# EAGLE board Sensor Board (EAGLE 6.5.0), part 1 of 2
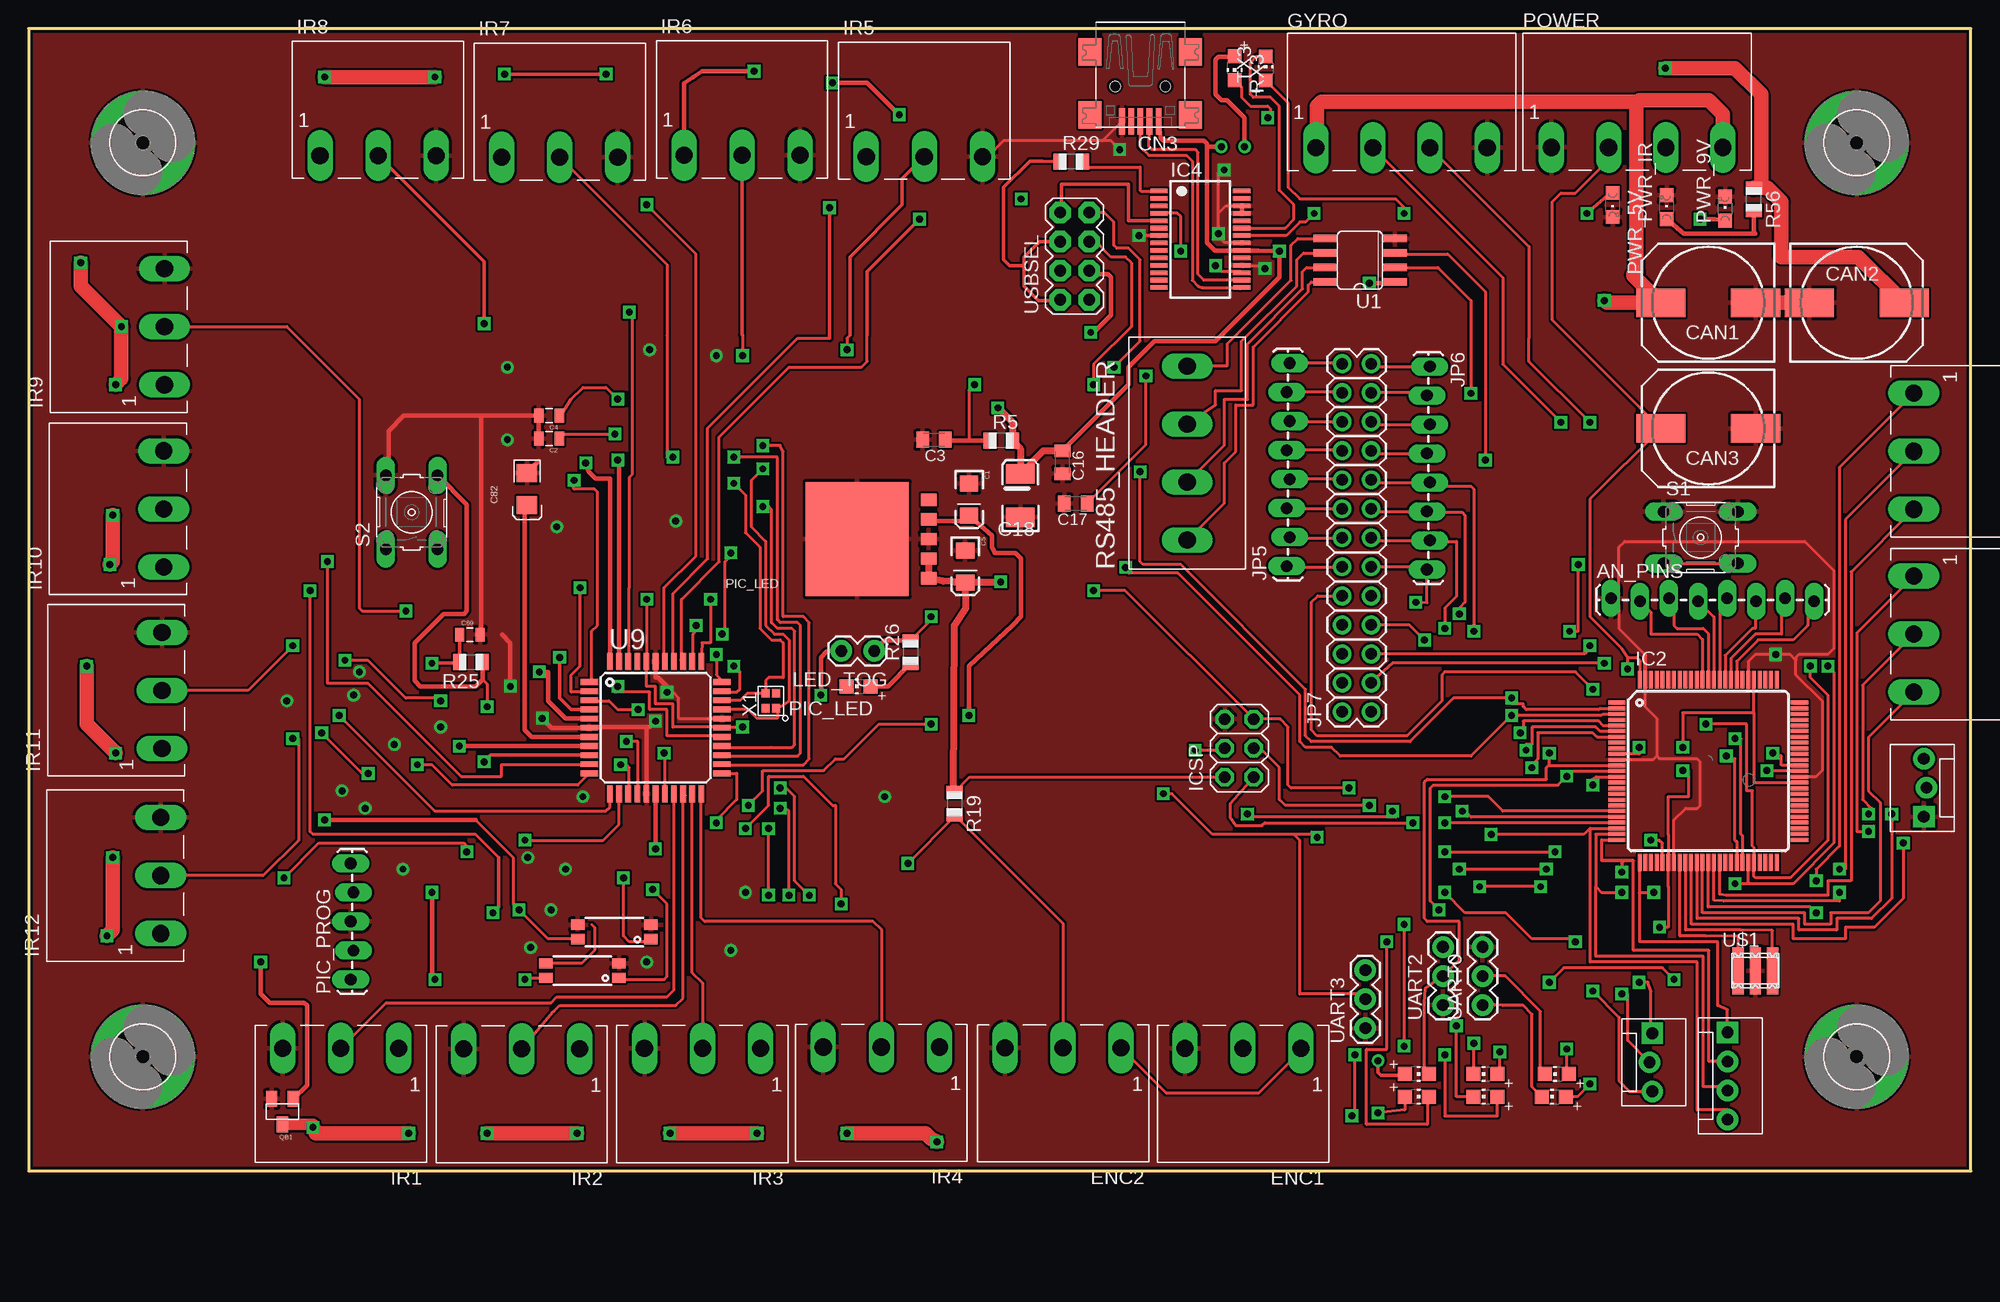
[diagram p3: board, top side]
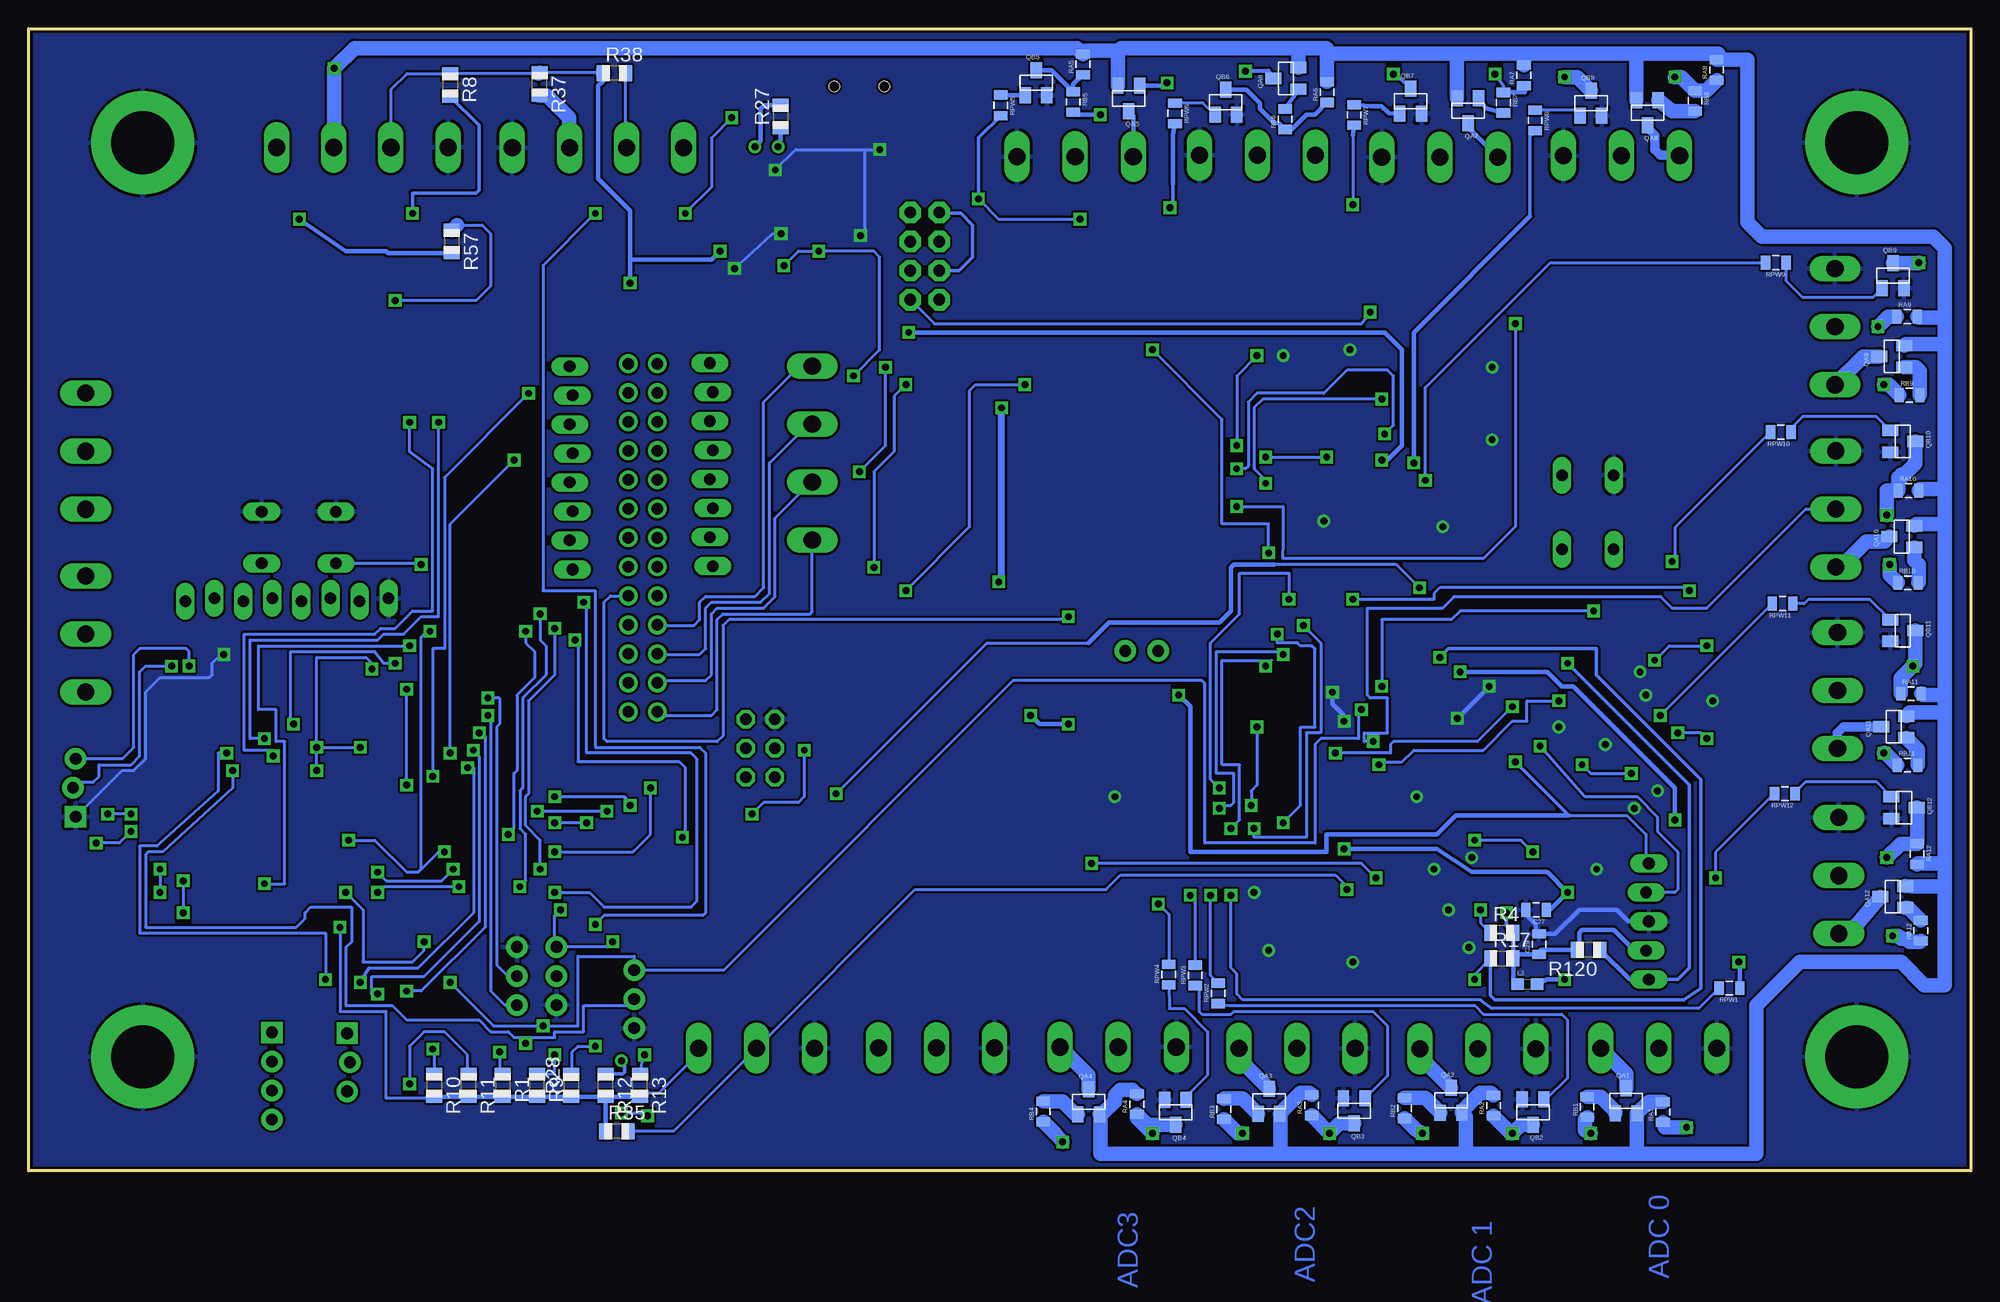
[diagram p4: board, bottom side, seen from below]

Size 170 x 100 mm. Coordinates in mm from the lower left corner, seen from the top.
Outline: 0,100 0,0 170,0 170,100 0,100
Copper layers (1*16): Top 0.035mm / dielectric 1.5mm / Bottom 0.035mm
Design rules "default": minimum track width 8mil, minimum drill 20mil, track to track 8mil, track to pad 8mil, pad to pad 8mil, via to via 8mil, smd to smd 8mil, copper to edge 10mil, drill to drill 8mil, minimum pad ring 12mil, minimum via ring 10mil, stop-mask expansion 4mil, vias tented up to drill 25mil, thermal gap 10mil
Net classes: 2 gnd: width 0.305 mm, drill 0.711 mm, clearance 0.203 mm; 3 usbvcc: width 0.508 mm, drill 0.711 mm, clearance 0.203 mm

## Footprints (pad centres in the part's own frame; a part is rotated, then mirrored left to right if it is on the bottom)
1X08_LOCK_LONGPADS = drill 1.016 long: 1 0,0.127; 2 2.54,-0.127; 3 5.08,0.127; 4 7.62,-0.127; 5 10.16,0.127; 6 12.7,-0.127; 7 15.24,0.127; 8 17.78,-0.127
EIA3216 = smd 1.4 x 1.6: A 1.4,0; C -1.4,0
0805 = smd 0.8 x 1.2: 1 -0.9,0; 2 0.9,0
C0805K = smd 1.1 x 1.4: 1 -1,0; 2 1,0
EIA3528-KIT = smd 1.7 x 2.5: A 1.9,0; C -1.9,0
POLC1206 = smd 1.6 x 1.8: 1 -1.4,0; 2 1.4,0
140CLH-1010 = smd 4.3 x 2.5: + 4.15,0; - -4.15,0
USB-MINIB = smd 0.5 x 2.308: D+ 0,4.064; D- -0.8,4.064; GND 1.6,4.064; ID 0.8,4.064; VBUS -1.6,4.064 | smd 2 x 2.4: GND1 -4.4,-2; GND2 -4.4,3.5; GND3 4.4,3.5; GND4 4.4,-2 | hole 0.9: -2.2,1; 2.2,1
MOLEX-1X3_LOCK = drill 1.016 pad 1.88 square: 1 0,0.127 | drill 1.016 pad 1.88: 2 2.54,-0.127; 3 5.08,0.127
HRP5 = smd 1.07 x 1.37: 1 -3.44,0; 2 -1.72,0; 3 0,0; 4 1.72,0; 5 3.44,0 | smd 10 x 9: G 0,6.254
M3 = drill 1.5 long: 1 -5.08,0; 2 0,0; 3 5.08,0
M4 = drill 1.5 long: 1 0,0; 2 5,0; 3 10,0; 4 15,0
5,5-PAD = drill 5.5 pad 9: B5,5 0,0
TQFP100 = smd 1.5 x 0.35: 1 -8,6; 2 -8,5.5; 3 -8,5; 4 -8,4.5; 5 -8,4; 6 -8,3.5; 7 -8,3; 8 -8,2.5; 9 -8,2; 10 -8,1.5; 11 -8,1; 12 -8,0.5; 13 -8,0; 14 -8,-0.5; 15 -8,-1; 16 -8,-1.5; 17 -8,-2; 18 -8,-2.5; 19 -8,-3; 20 -8,-3.5; 21 -8,-4; 22 -8,-4.5; 23 -8,-5; 24 -8,-5.5; 25 -8,-6; 51 8,-6; 52 8,-5.5; 53 8,-5; 54 8,-4.5; 55 8,-4; 56 8,-3.5; 57 8,-3; 58 8,-2.5; 59 8,-2; 60 8,-1.5; 61 8,-1; 62 8,-0.5; 63 8,0; 64 8,0.5; 65 8,1; 66 8,1.5; 67 8,2; 68 8,2.5; 69 8,3; 70 8,3.5; 71 8,4; 72 8,4.5; 73 8,5; 74 8,5.5; 75 8,6 | smd 0.35 x 1.5: 26 -6,-8; 27 -5.5,-8; 28 -5,-8; 29 -4.5,-8; 30 -4,-8; 31 -3.5,-8; 32 -3,-8; 33 -2.5,-8; 34 -2,-8; 35 -1.5,-8; 36 -1,-8; 37 -0.5,-8; 38 0,-8; 39 0.5,-8; 40 1,-8; 41 1.5,-8; 42 2,-8; 43 2.5,-8; 44 3,-8; 45 3.5,-8; 46 4,-8; 47 4.5,-8; 48 5,-8; 49 5.5,-8; 50 6,-8; 76 6,8; 77 5.5,8; 78 5,8; 79 4.5,8; 80 4,8; 81 3.5,8; 82 3,8; 83 2.5,8; 84 2,8; 85 1.5,8; 86 1,8; 87 0.5,8; 88 0,8; 89 -0.5,8; 90 -1,8; 91 -1.5,8; 92 -2,8; 93 -2.5,8; 94 -3,8; 95 -3.5,8; 96 -4,8; 97 -4.5,8; 98 -5,8; 99 -5.5,8; 100 -6,8
SSOP28 = smd 0.4 x 1.5: 1 -4.225,-3.625; 2 -3.575,-3.625; 3 -2.925,-3.625; 4 -2.275,-3.625; 5 -1.625,-3.625; 6 -0.975,-3.625; 7 -0.325,-3.625; 8 0.325,-3.625; 9 0.975,-3.625; 10 1.625,-3.625; 11 2.275,-3.625; 12 2.925,-3.625; 13 3.575,-3.625; 14 4.225,-3.625; 15 4.225,3.625; 16 3.575,3.625; 17 2.925,3.625; 18 2.275,3.625; 19 1.625,3.625; 20 0.975,3.625; 21 0.325,3.625; 22 -0.325,3.625; 23 -0.975,3.625; 24 -1.625,3.625; 25 -2.275,3.625; 26 -2.925,3.625; 27 -3.575,3.625; 28 -4.225,3.625
2X03 = drill 1.016 octagon: 1 -2.54,-1.27; 2 -2.54,1.27; 3 0,-1.27; 4 0,1.27; 5 2.54,-1.27; 6 2.54,1.27
2X13 = drill 1.016 pad 1.651: 1 0,0; 2 0,2.54; 3 2.54,0; 4 2.54,2.54; 5 5.08,0; 6 5.08,2.54; 7 7.62,0; 8 7.62,2.54; 9 10.16,0; 10 10.16,2.54; 11 12.7,0; 12 12.7,2.54; 13 15.24,0; 14 15.24,2.54; 15 17.78,0; 16 17.78,2.54; 17 20.32,0; 18 20.32,2.54; 19 22.86,0; 20 22.86,2.54; 21 25.4,0; 22 25.4,2.54; 23 27.94,0; 24 27.94,2.54; 25 30.48,0; 26 30.48,2.54
0603 = smd 1.1 x 1: 1 -0.85,0; 2 0.85,0
CHIP-LED0805 = smd 1.2 x 1.2: A 0,-1.05; C 0,1.05
1X02_LOCK = drill 1.016 pad 1.88: 1 -0.178,0; 2 2.718,0
SSOP-4 = smd 1.2 x 0.9: 1 -3.2,0.67; 2 -3.2,-0.6; 3 3.2,-0.6; 4 3.2,0.67
1X05_LOCK_LONGPADS = drill 1.016 long: 1 0,0; 2 2.54,-0.254; 3 5.08,0; 4 7.62,-0.254; 5 10.16,0
MOLEX-1X4 = drill 1.016 pad 1.88 square: 1 0,0 | drill 1.016 pad 1.88: 2 2.54,0; 3 5.08,0; 4 7.62,0
CHIPLED_0805 = smd 1.2 x 1.2: A 0,-1.05; C 0,1.05
SOT23 = smd 1 x 1.4: 1 -0.95,-1.1; 2 0.95,-1.1; 3 0,1.1
R0805 = smd 1.1 x 1.4: 1 -1,0; 2 1,0
M4-90 = drill 1.5 long: 1 0,0; 2 5.08,0; 3 10.16,0; 4 15.24,0
B3F-10XX = drill 1.016 long: 1 -3.251,2.261; 2 3.251,2.261; 3 -3.251,-2.261; 4 3.251,-2.261
SO08 = smd 0.66 x 2.032: 1 -1.905,-3.073; 2 -0.635,-3.073; 3 0.635,-3.073; 4 1.905,-3.073; 5 1.905,3.073; 6 0.635,3.073; 7 -0.635,3.073; 8 -1.905,3.073
TQFP-44 = smd 1.5 x 0.5: 1 -5.8,4; 2 -5.8,3.2; 3 -5.8,2.4; 4 -5.8,1.6; 5 -5.8,0.8; 6 -5.8,0; 7 -5.8,-0.8; 8 -5.8,-1.6; 9 -5.8,-2.4; 10 -5.8,-3.2; 11 -5.8,-4; 23 5.8,-4; 24 5.8,-3.2; 25 5.8,-2.4; 26 5.8,-1.6; 27 5.8,-0.8; 28 5.8,0; 29 5.8,0.8; 30 5.8,1.6; 31 5.8,2.4; 32 5.8,3.2; 33 5.8,4 | smd 0.5 x 1.5: 12 -4,-5.8; 13 -3.2,-5.8; 14 -2.4,-5.8; 15 -1.6,-5.8; 16 -0.8,-5.8; 17 0,-5.8; 18 0.8,-5.8; 19 1.6,-5.8; 20 2.4,-5.8; 21 3.2,-5.8; 22 4,-5.8; 34 4,5.8; 35 3.2,5.8; 36 2.4,5.8; 37 1.6,5.8; 38 0.8,5.8; 39 0,5.8; 40 -0.8,5.8; 41 -1.6,5.8; 42 -2.4,5.8; 43 -3.2,5.8; 44 -4,5.8
AWCSR = smd 1 x 4.1: 1 -1.5,0; 2 0,0; 3 1.5,0
1X03 = drill 1.016 pad 1.88: 1 0,0; 2 2.54,0; 3 5.08,0
2X4 = drill 1.016 pad 1.88 octagon: 1 -3.81,-1.27; 2 -3.81,1.27; 3 -1.27,-1.27; 4 -1.27,1.27; 5 1.27,-1.27; 6 1.27,1.27; 7 3.81,-1.27; 8 3.81,1.27
XRCGB-CYL = smd 0.75 x 0.7: 1 -0.65,-0.45; 2 0.65,-0.45; 3 0.65,0.45; 4 -0.65,0.45

## Placement (x,y rotation side)
AN_PINS  [1X08_LOCK_LONGPADS]  138.5,50 0 top
C1  10uF  [EIA3216]  82.31,58.76 270 top
C2  33pF  [0805]  45.56,64.11 180 top
C3  22pF  [C0805K]  79.25,64.01 180 top
C4  33pF  [0805]  45.56,66.11 180 top
C5  10uF  [EIA3216]  81.98,52.93 270 top
C16  0.1uF  [C0805K]  90.48,62.04 270 top
C17  0.1uF  [C0805K]  91.65,58.43 180 top
C18  10uF  [EIA3528-KIT]  86.81,59.12 90 top
C27  .1uF  [0805]  38.05,22.85 180 bottom
C29  .1uF  [0805]  37.8,19.85 90 bottom
C69  .1uF  [0805]  38.62,46.94 0 top
C82  10uF  [POLC1206]  43.62,59.68 90 top
CAN1  EMVY160ADA101MF55G  [140CLH-1010]  147,76 180 top
CAN2  EMVY160ADA101MF55G  [140CLH-1010]  160,76 0 top
CAN3  EMVY160ADA101MF55G  [140CLH-1010]  147,65 180 top
CN3  MINIB  [USB-MINIB]  97.3,95.95 180 top
COTL_BOX  Control Board  [MOLEX-1X3_LOCK]  166,31 90 top
DC-DC  BA50DD0WHFP-TR  [HRP5]  78.77,55.32 90 top
DIG1  Digital1  [M3]  165,47 270 top
DIG2  Digital2  [M3]  165,63 270 top
ENC1  Encoder1  [M3]  106.29,10.75 180 top
ENC2  Encoder2  [M3]  90.54,10.78 180 top
GYRO  EUROMAG-4  [M4]  112.66,89.58 0 top
H1  MOUNT-PAD-ROUND5.5  [5,5-PAD]  10,10 0 top
H2  MOUNT-PAD-ROUND5.5  [5,5-PAD]  10,90 0 top
H3  MOUNT-PAD-ROUND5.5  [5,5-PAD]  160,10 0 top
H4  MOUNT-PAD-ROUND5.5  [5,5-PAD]  160,90 0 top
IC2  ATMEGA1280-16AU  [TQFP100]  147,35 0 top
IC4  FT232RL  [SSOP28]  102.55,81.56 270 top
ICSP  ICSP  [2X03]  105.96,37.01 90 top
IR1  Analog1  [M3]  27.32,10.75 180 top
IR2  Analog1  [M3]  43.15,10.7 180 top
IR3  Analog1  [M3]  58.98,10.73 180 top
IR4  Analog1  [M3]  74.64,10.85 180 top
IR5  Analog1  [M3]  78.4,88.79 0 top
IR6  Analog1  [M3]  62.45,88.92 0 top
IR7  Analog1  [M3]  46.49,88.74 0 top
IR8  Analog1  [M3]  30.58,88.89 0 top
IR9  Analog1  [M3]  11.9,73.9 90 top
IR10  Analog1  [M3]  11.82,57.95 90 top
IR11  Analog1  [M3]  11.68,42.07 90 top
IR12  Analog1  [M3]  11.57,25.86 90 top
JP5  [1X08_LOCK_LONGPADS]  110.24,52.94 90 top
JP6  [1X08_LOCK_LONGPADS]  122.52,70.43 270 top
JP7  M13X22X13  [2X13]  117.51,40.18 90 top
L3  FERITEBEAD  [0603]  38.81,16.34 0 bottom
LED1  RXD3  [CHIP-LED0805]  127.5,8.5 90 top
LED2  TXD3  [CHIP-LED0805]  127.5,6.5 90 top
LED5  RXD0  [CHIP-LED0805]  133.75,8.5 90 top
LED6  TXD0  [CHIP-LED0805]  133.5,6.5 90 top
LED8  RXD2  [CHIP-LED0805]  121.5,8.5 270 top
LED10  TXD2  [CHIP-LED0805]  121.5,6.5 270 top
LED_TOG  M02LOCK  [1X02_LOCK]  73.83,45.52 180 top
OPTO1  TCMT1103-OPTO  [SSOP-4]  48.47,17.58 180 top
OPTO2  TCMT1103-OPTO  [SSOP-4]  51.27,20.95 180 top
PIC_LED  Yellow  [CHIP-LED0805]  72.64,42.42 90 top
PIC_PROG  [1X05_LOCK_LONGPADS]  28.19,16.76 90 top
POWER  EUROMAG-4  [M4]  133.29,89.59 0 top
PWM  [MOLEX-1X4]  148.7,12.13 270 top
PWM2  PWM2  [MOLEX-1X3_LOCK]  141.99,12.05 270 top
PWR_5V  green  [CHIPLED_0805]  138.64,84.56 180 top
PWR_9V  green  [CHIPLED_0805]  148.48,84.24 0 top
PWR_IR  green  [CHIPLED_0805]  143.36,84.36 0 top
QA1  MMBT3906  [SOT23]  30.17,6.13 0 bottom
QA2  MMBT3906  [SOT23]  45.5,6.18 0 bottom
QA3  MMBT3906  [SOT23]  61.44,6.09 0 bottom
QA4  MMBT3906  [SOT23]  77.22,6.05 0 bottom
QA5  MMBT3906  [SOT23]  73.71,93.88 180 bottom
QA6  MMBT3906  [SOT23]  59.96,95.64 90 bottom
QA7  MMBT3906  [SOT23]  44.02,92.82 180 bottom
QA8  MMBT3906  [SOT23]  28.32,92.64 180 bottom
QA9  MMBT3906  [SOT23]  6.93,71.3 90 bottom
QA10  MMBT3906  [SOT23]  6.04,55.53 90 bottom
QA11  MMBT3906  [SOT23]  6.75,38.87 90 bottom
QA12  MMBT3906  [SOT23]  6.84,24 90 bottom
QB1  MMBT5088  [SOT23]  22.23,5.2 180 top
QB2  MMBT5088  [SOT23]  38.33,5.15 180 bottom
QB3  MMBT5088  [SOT23]  53.97,5.26 180 bottom
QB4  MMBT5088  [SOT23]  69.61,5.12 180 bottom
QB5  MMBT5088  [SOT23]  81.82,95.27 0 bottom
QB6  MMBT5088  [SOT23]  65.21,93.54 0 bottom
QB7  MMBT5088  [SOT23]  49.03,93.63 0 bottom
QB8  MMBT5088  [SOT23]  33.26,93.46 0 bottom
QB9  MMBT5088  [SOT23]  6.82,78.36 0 bottom
QB10  MMBT5088  [SOT23]  5.97,63.87 270 bottom
QB11  MMBT5088  [SOT23]  5.98,47.31 270 bottom
QB12  MMBT5088  [SOT23]  5.86,31.81 270 bottom
R1  1k  [R0805]  128.5,7.5 270 bottom
R4  2k  [R0805]  41.05,20.85 0 bottom
R5  10K  [R0805]  85.13,63.94 0 top
R8  1K  [R0805]  133.08,95.05 270 bottom
R9  1k  [R0805]  125.5,7.5 270 bottom
R10  1k  [R0805]  134.5,7.5 270 bottom
R11  1k  [R0805]  131.5,7.5 270 bottom
R12  1k  [R0805]  119.5,7.5 270 bottom
R13  1k  [R0805]  116.5,7.5 270 bottom
R17  2k  [R0805]  41.05,18.6 0 bottom
R19  499  [R0805]  81.05,32.15 270 top
R25  100  [R0805]  38.72,44.55 180 top
R26  499  [R0805]  77.2,45.42 90 top
R27  1K  [R0805]  104.18,92.3 90 bottom
R28  1K  [R0805]  122.5,7.5 90 bottom
R29  10  [R0805]  91.25,88.36 0 top
R35  499  [R0805]  118.5,3.48 0 bottom
R37  2.2k  [R0805]  125.29,95.13 270 bottom
R38  2.2k  [R0805]  118.73,96.1 0 bottom
R56  1K  [R0805]  151,85.06 270 top
R57  1K  [R0805]  132.96,81.36 270 bottom
R120  10k  [R0805]  33.47,19.36 180 bottom
RA1  10k  [0805]  26.97,5.15 90 bottom
RA2  10k  [0805]  41.78,5.73 90 bottom
RA3  10k  [0805]  57.7,5.76 90 bottom
RA4  10k  [0805]  73,5.84 90 bottom
RA5  10k  [0805]  77.71,96.87 90 bottom
RA6  10k  [0805]  56.34,94.44 90 bottom
RA7  10k  [0805]  39.13,95.91 90 bottom
RA8  10k  [0805]  22.26,96.38 90 bottom
RA9  10k  [0805]  5.58,74.79 0 bottom
RA10  10k  [0805]  5.47,59.55 0 bottom
RA11  10k  [0805]  5.24,41.79 0 bottom
RA12  10k  [0805]  4.71,27.75 270 bottom
RB1  1k  [0805]  33.59,5.6 90 bottom
RB2  1k  [0805]  49.57,5.49 90 bottom
RB3  1k  [0805]  65.37,5.41 90 bottom
RB4  1k  [0805]  81.19,5.21 90 bottom
RB5  1k  [0805]  78.57,93.57 270 bottom
RB6  1k  [0805]  60.02,92.07 90 bottom
RB7  1k  [0805]  40.92,93.51 270 bottom
RB8  1k  [0805]  24.15,93.67 270 bottom
RB9  1k  [0805]  5.39,67.91 0 bottom
RB10  1k  [0805]  5.52,51.49 0 bottom
RB11  1k  [0805]  5.54,35.53 0 bottom
RB12  1k  [0805]  4.39,21.04 90 bottom
RPW1  1k  [0805]  21.14,16.02 180 bottom
RPW2  1k  [0805]  65.87,15.55 90 bottom
RPW3  1k  [0805]  67.9,17.12 90 bottom
RPW4  1k  [0805]  70.2,17.2 90 bottom
RPW5  1k  [0805]  84.91,93.28 270 bottom
RPW6  1k  [0805]  69.66,92.58 270 bottom
RPW7  1k  [0805]  53.98,92.44 270 bottom
RPW8  1k  [0805]  38.14,91.96 270 bottom
RPW9  1k  [0805]  17.08,79.51 180 bottom
RPW10  1k  [0805]  16.64,64.68 180 bottom
RPW11  1k  [0805]  16.49,49.66 180 bottom
RPW12  1k  [0805]  16.29,33.04 180 bottom
RS485_HEADER  RS485  [M4-90]  101.41,55.22 90 top
RX3  Green  [CHIP-LED0805]  105.57,96.53 180 top
S1  [B3F-10XX]  146.35,55.45 0 top
S2  [B3F-10XX]  33.53,57.66 90 top
TX3  Red  [CHIP-LED0805]  108.27,96.51 0 top
U1  ISL83077  [SO08]  116.52,79.72 90 top
U9  DSPIC33FJ128GP804  [TQFP-44]  54.88,38.79 0 top
U$1  [AWCSR]  151.13,17.53 0 top
UART0  UART0  [1X03]  127.26,14.53 90 top
UART2  UART2  [1X03]  123.79,14.53 90 top
UART3  UART3  [1X03]  117,12.5 90 top
USBSEL  M04X2  [2X4]  91.56,80.08 90 top
X1  25 MHz  [XRCGB-CYL]  64.96,41.16 90 top